# Altium schematic sheet spine_2.SchDoc
size 76 x 93 mm; Origin: Eagle; OriginPath: C:\Users\jpvgo\OneDrive\Documents\Atombot Fase 2\Helium_Electronics\July31CommBrd\SPIne-master\SPIne_V2\SPIne\spine.sch; OriginSheet: 3; OriginDescription: UP Board
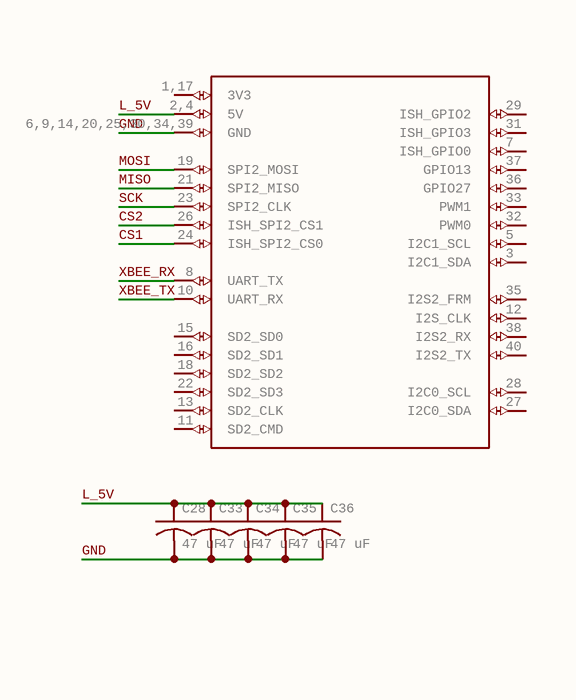
[diagram p0: spine_2.SchDoc]

## Parts
C28  47 uF  [C1206K]
C33  47 uF  [C1206K]
C34  47 uF  [C1206K]
C35  47 uF  [C1206K]
C36  47 uF  [C1206K]
U$2  UP_BOARD  [UP_BOARD]  (value not drawn)

## Nets
CS1: U$2.24(ISH_SPI2_CS0)
CS2: U$2.26(ISH_SPI2_CS1)
GND: C28.2 C33.2 C34.2 C35.2 C36.2 U$2.6,9,14,20,25,30,34,39(GND)
L_5V: C28.1 C33.1 C34.1 C35.1 C36.1 U$2.2,4(5V)
MISO: U$2.21(SPI2_MISO)
MOSI: U$2.19(SPI2_MOSI)
SCK: U$2.23(SPI2_CLK)
XBEE_RX: U$2.8(UART_TX)
XBEE_TX: U$2.10(UART_RX)

Not connected (* = marked no-connect by the designer): U$2 1,17(3V3) 3(I2C1_SDA) 5(I2C1_SCL) 7(ISH_GPIO0) 11(SD2_CMD) 12(I2S_CLK) 13(SD2_CLK) 15(SD2_SD0) 16(SD2_SD1) 18(SD2_SD2) 22(SD2_SD3) 27(I2C0_SDA) 28(I2C0_SCL) 29(ISH_GPIO2) 31(ISH_GPIO3) 32(PWM0) 33(PWM1) 35(I2S2_FRM) 36(GPIO27) 37(GPIO13) 38(I2S2_RX) 40(I2S2_TX)

## Library data of the parts
C28 C33-C36 = C-USC1206K: CAPACITOR, American symbol; GateName_1: G$1; SymbolName_1: C-US; DeviceName: C1206K; LibraryName: rcl; DeviceSetName: C-US
U$2 = UP_BOARD: GateName_1: G$1; SymbolName_1: UP_BOARD; LibraryName: BenLibrary; DeviceSetName: UP_BOARD